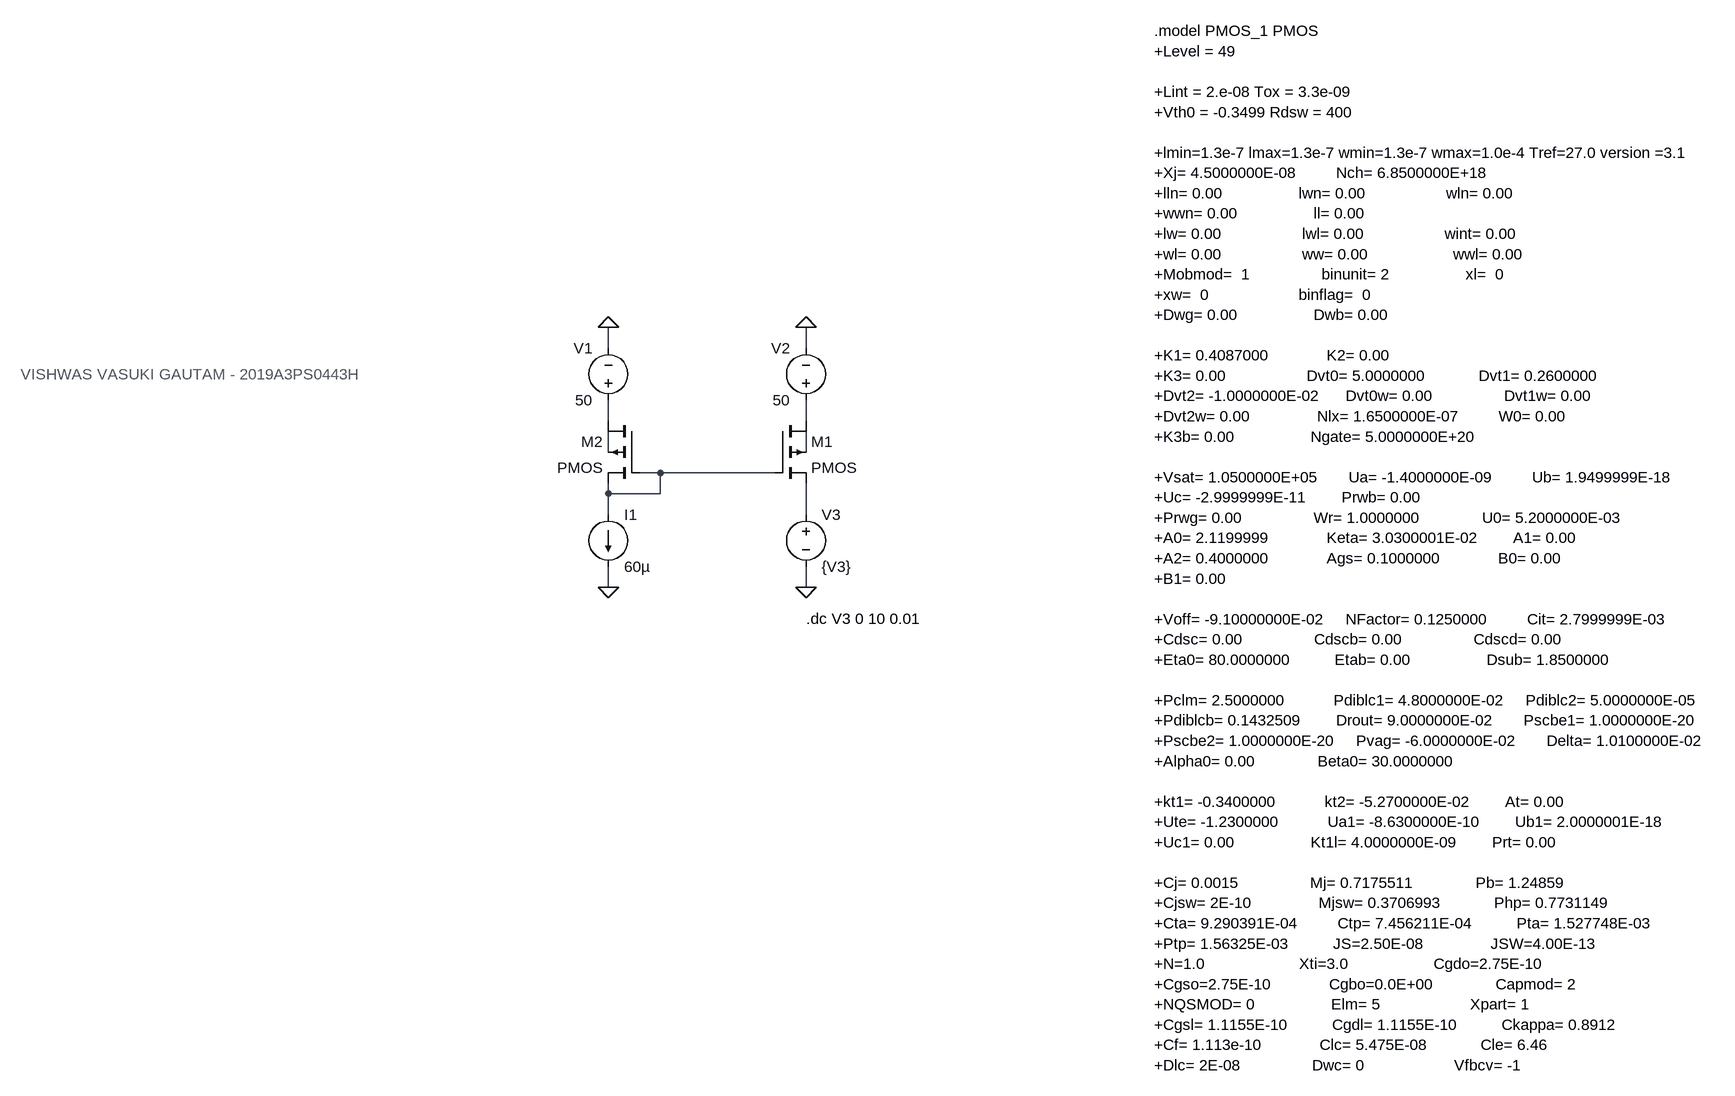
[diagram p0: schematic Current_Mirror_PMOS.asc]
Current_Mirror_PMOS.asc, the LTspice schematic file:
Version 4
SHEET 1 964 680
WIRE -848 -1952 -848 -1984
WIRE -544 -1952 -544 -1984
WIRE -848 -1840 -848 -1872
WIRE -544 -1840 -544 -1872
WIRE -848 -1792 -848 -1824
WIRE -544 -1792 -544 -1824
WIRE -768 -1760 -800 -1760
WIRE -592 -1760 -768 -1760
WIRE -848 -1728 -848 -1744
WIRE -768 -1728 -768 -1760
WIRE -768 -1728 -848 -1728
WIRE -848 -1696 -848 -1728
WIRE -544 -1696 -544 -1744
WIRE -848 -1584 -848 -1616
WIRE -544 -1584 -544 -1616
FLAG -848 -1984 0
FLAG -544 -1984 0
FLAG -848 -1584 0
FLAG -544 -1584 0
SYMBOL pmos4 -592 -1840 R0
SYMATTR InstName M1
SYMATTR Value2 l=15u w=75u
SYMBOL voltage -848 -1856 R180
WINDOW 0 24 96 Left 2
WINDOW 3 24 16 Left 2
WINDOW 123 0 0 Left 2
WINDOW 39 0 0 Left 2
SYMATTR InstName V1
SYMATTR Value 50
SYMBOL voltage -544 -1856 R180
WINDOW 0 24 96 Left 2
WINDOW 3 24 16 Left 2
WINDOW 123 0 0 Left 2
WINDOW 39 0 0 Left 2
SYMATTR InstName V2
SYMATTR Value 50
SYMBOL current -848 -1696 R0
WINDOW 123 0 0 Left 2
WINDOW 39 0 0 Left 2
SYMATTR InstName I1
SYMATTR Value 60µ
SYMBOL pmos4 -800 -1840 M0
SYMATTR InstName M2
SYMATTR Value2 l=15u w=75u
SYMBOL voltage -544 -1712 R0
WINDOW 123 0 0 Left 2
WINDOW 39 0 0 Left 2
SYMATTR InstName V3
SYMATTR Value {V3}
TEXT -544 -1536 Left 2 !.dc V3 0 10 0.01
TEXT -8 -2440 Left 2 !.model PMOS_1 PMOS\n+Level = 49\n \n+Lint = 2.e-08 Tox = 3.3e-09 \n+Vth0 = -0.3499 Rdsw = 400 \n \n+lmin=1.3e-7 lmax=1.3e-7 wmin=1.3e-7 wmax=1.0e-4 Tref=27.0 version =3.1\n+Xj= 4.5000000E-08         Nch= 6.8500000E+18 \n+lln= 0.00                 lwn= 0.00                  wln= 0.00\n+wwn= 0.00                 ll= 0.00\n+lw= 0.00                  lwl= 0.00                  wint= 0.00\n+wl= 0.00                  ww= 0.00                   wwl= 0.00\n+Mobmod=  1                binunit= 2                 xl=  0\n+xw=  0                    binflag=  0\n+Dwg= 0.00                 Dwb= 0.00 \n \n+K1= 0.4087000             K2= 0.00 \n+K3= 0.00                  Dvt0= 5.0000000            Dvt1= 0.2600000 \n+Dvt2= -1.0000000E-02      Dvt0w= 0.00                Dvt1w= 0.00 \n+Dvt2w= 0.00               Nlx= 1.6500000E-07         W0= 0.00 \n+K3b= 0.00                 Ngate= 5.0000000E+20 \n \n+Vsat= 1.0500000E+05       Ua= -1.4000000E-09         Ub= 1.9499999E-18 \n+Uc= -2.9999999E-11        Prwb= 0.00 \n+Prwg= 0.00                Wr= 1.0000000              U0= 5.2000000E-03 \n+A0= 2.1199999             Keta= 3.0300001E-02        A1= 0.00 \n+A2= 0.4000000             Ags= 0.1000000             B0= 0.00 \n+B1= 0.00 \n \n+Voff= -9.10000000E-02     NFactor= 0.1250000         Cit= 2.7999999E-03 \n+Cdsc= 0.00                Cdscb= 0.00                Cdscd= 0.00 \n+Eta0= 80.0000000          Etab= 0.00                 Dsub= 1.8500000 \n \n+Pclm= 2.5000000           Pdiblc1= 4.8000000E-02     Pdiblc2= 5.0000000E-05 \n+Pdiblcb= 0.1432509        Drout= 9.0000000E-02       Pscbe1= 1.0000000E-20 \n+Pscbe2= 1.0000000E-20     Pvag= -6.0000000E-02       Delta= 1.0100000E-02 \n+Alpha0= 0.00              Beta0= 30.0000000 \n \n+kt1= -0.3400000           kt2= -5.2700000E-02        At= 0.00 \n+Ute= -1.2300000           Ua1= -8.6300000E-10        Ub1= 2.0000001E-18 \n+Uc1= 0.00                 Kt1l= 4.0000000E-09        Prt= 0.00 \n \n+Cj= 0.0015                Mj= 0.7175511              Pb= 1.24859\n+Cjsw= 2E-10               Mjsw= 0.3706993            Php= 0.7731149\n+Cta= 9.290391E-04         Ctp= 7.456211E-04          Pta= 1.527748E-03\n+Ptp= 1.56325E-03          JS=2.50E-08               JSW=4.00E-13\n+N=1.0                     Xti=3.0                   Cgdo=2.75E-10\n+Cgso=2.75E-10             Cgbo=0.0E+00              Capmod= 2\n+NQSMOD= 0                 Elm= 5                    Xpart= 1\n+Cgsl= 1.1155E-10          Cgdl= 1.1155E-10          Ckappa= 0.8912\n+Cf= 1.113e-10             Clc= 5.475E-08            Cle= 6.46\n+Dlc= 2E-08                Dwc= 0                    Vfbcv= -1
TEXT -1752 -1912 Left 2 ;VISHWAS VASUKI GAUTAM - 2019A3PS0443H

The netlist it stands for:
* Current_Mirror_PMOS.asc
M1 N002 N005 N006 N004 PMOS l=15u w=75u
V1 N001 0 50
V2 N002 0 50
I1 N005 0 60µ
M2 N001 N005 N005 N003 PMOS l=15u w=75u
V3 N006 0 {V3}
.model NMOS NMOS
.model PMOS PMOS
.lib standard.mos
.dc V3 0 10 0.01
.model PMOS_1 PMOS
+Level = 49
+Lint = 2.e-08 Tox = 3.3e-09
+Vth0 = -0.3499 Rdsw = 400
+lmin=1.3e-7 lmax=1.3e-7 wmin=1.3e-7 wmax=1.0e-4 Tref=27.0 version =3.1
+Xj= 4.5000000E-08         Nch= 6.8500000E+18
+lln= 0.00                 lwn= 0.00                  wln= 0.00
+wwn= 0.00                 ll= 0.00
+lw= 0.00                  lwl= 0.00                  wint= 0.00
+wl= 0.00                  ww= 0.00                   wwl= 0.00
+Mobmod=  1                binunit= 2                 xl=  0
+xw=  0                    binflag=  0
+Dwg= 0.00                 Dwb= 0.00
+K1= 0.4087000             K2= 0.00
+K3= 0.00                  Dvt0= 5.0000000            Dvt1= 0.2600000
+Dvt2= -1.0000000E-02      Dvt0w= 0.00                Dvt1w= 0.00
+Dvt2w= 0.00               Nlx= 1.6500000E-07         W0= 0.00
+K3b= 0.00                 Ngate= 5.0000000E+20
+Vsat= 1.0500000E+05       Ua= -1.4000000E-09         Ub= 1.9499999E-18
+Uc= -2.9999999E-11        Prwb= 0.00
+Prwg= 0.00                Wr= 1.0000000              U0= 5.2000000E-03
+A0= 2.1199999             Keta= 3.0300001E-02        A1= 0.00
+A2= 0.4000000             Ags= 0.1000000             B0= 0.00
+B1= 0.00
+Voff= -9.10000000E-02     NFactor= 0.1250000         Cit= 2.7999999E-03
+Cdsc= 0.00                Cdscb= 0.00                Cdscd= 0.00
+Eta0= 80.0000000          Etab= 0.00                 Dsub= 1.8500000
+Pclm= 2.5000000           Pdiblc1= 4.8000000E-02     Pdiblc2= 5.0000000E-05
+Pdiblcb= 0.1432509        Drout= 9.0000000E-02       Pscbe1= 1.0000000E-20
+Pscbe2= 1.0000000E-20     Pvag= -6.0000000E-02       Delta= 1.0100000E-02
+Alpha0= 0.00              Beta0= 30.0000000
+kt1= -0.3400000           kt2= -5.2700000E-02        At= 0.00
+Ute= -1.2300000           Ua1= -8.6300000E-10        Ub1= 2.0000001E-18
+Uc1= 0.00                 Kt1l= 4.0000000E-09        Prt= 0.00
+Cj= 0.0015                Mj= 0.7175511              Pb= 1.24859
+Cjsw= 2E-10               Mjsw= 0.3706993            Php= 0.7731149
+Cta= 9.290391E-04         Ctp= 7.456211E-04          Pta= 1.527748E-03
+Ptp= 1.56325E-03          JS=2.50E-08               JSW=4.00E-13
+N=1.0                     Xti=3.0                   Cgdo=2.75E-10
+Cgso=2.75E-10             Cgbo=0.0E+00              Capmod= 2
+NQSMOD= 0                 Elm= 5                    Xpart= 1
+Cgsl= 1.1155E-10          Cgdl= 1.1155E-10          Ckappa= 0.8912
+Cf= 1.113e-10             Clc= 5.475E-08            Cle= 6.46
+Dlc= 2E-08                Dwc= 0                    Vfbcv= -1
* VISHWAS VASUKI GAUTAM - 2019A3PS0443H
.backanno
.end